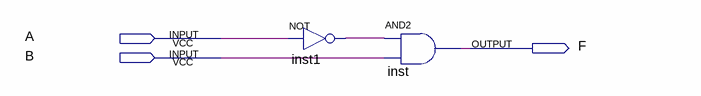
[diagram p0: schematic sheet]
// Quartus schematic menorque.bdf as structural Verilog: 2 symbols, 3 pins
module menorque (
  input  A,
  input  B,
  output F
);

  wire inst1_out;

  not inst1 (inst1_out, A);
  and inst (F, inst1_out, B);
endmodule
